# Altium schematic sheet Motor_Module.SchDoc: Название схемы
size 420 x 297 mm; ApprovedBy: Человек 1; CheckedBy: Человек 3; Author: Человек 2; DrawnBy: Человек; DocumentNumber: АЕСН.ХХХХХХ.ХХХЭ3; SheetNumber: x; SheetTotal: x; DocumentName: Sheet1.SCHDOC
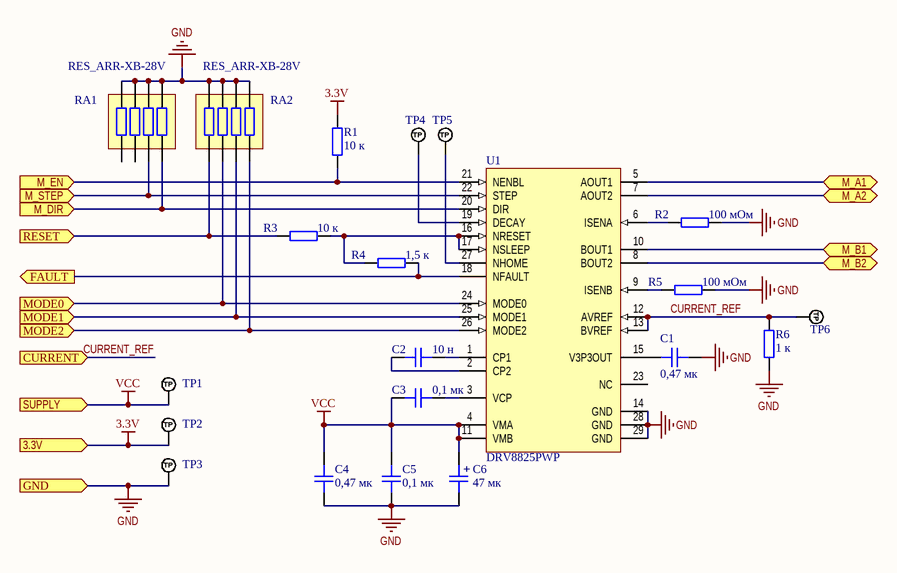
[diagram p0: Motor_Module.SchDoc]

## Parts
C1  0,47 мк  [CAP_0603]
C2  10 н  [CAP_0603]
C3  0,1 мк  [CAP_0603]
C4  0,47 мк  [CAP_0805]
C5  0,1 мк  [CAP_0805]
C6  47 мк  [CAP_AE_SMD_D6MM3_H5M55]
R1  10 к  [RES_0603]
R2  100 мОм  [RES_1206]
R3  10 к  [RES_0603]
R4  1,5 к  [RES_0603]
R5  100 мОм  [RES_1206]
R6  1 к  [RES_0603]
RA1  RES_ARR-XB-28V  [EXB-28V]
RA2  RES_ARR-XB-28V  [EXB-28V]
TP1  SUP  [PAD_RND_1MM]  (value not drawn)  (no BOM)
TP2  SUP  [PAD_RND_1MM]  (value not drawn)  (no BOM)
TP3  GND  [PAD_RND_1MM]  (value not drawn)  (no BOM)
TP4  DECAY  [PAD_RND_1MM]  (value not drawn)  (no BOM)
TP5  NHOME  [PAD_RND_1MM]  (value not drawn)  (no BOM)
TP6  CURRENT  [PAD_RND_1MM]  (value not drawn)  (no BOM)
U1  DRV8825PWP  [PWP0028C_L]

## Ports
3.3V (in), CURRENT (in), FAULT (out), GND (in), M_A1 (bidir), M_A2 (bidir), M_B1 (bidir), M_B2 (bidir), M_DIR (in), M_EN (in), M_STEP (in), MODE0 (in), MODE1 (in), MODE2 (in), RESET (in), SUPPLY (in)

## Nets
3.3V: R1.1 TP2.1(TP) ; port 3.3V
GND: C1.2 C4.2 C5.2 C6.2 R2.2 R5.2 R6.2 RA1.5 RA1.6 RA1.7 RA1.8 RA2.5 RA2.6 RA2.7 RA2.8 TP3.1(TP) U1.14(GND) U1.28(GND) U1.29(GND) ; port GND
VCC: C3.1 C4.1 C5.1 C6.1 TP1.1(TP) U1.4(VMA) U1.11(VMB) ; port SUPPLY
CURRENT_REF: R6.1 TP6.1(TP) U1.12(AVREF) U1.13(BVREF) ; port CURRENT
FAULT: R4.1 U1.18(NFAULT) ; port FAULT
M_A1: U1.5(AOUT1) ; port M_A1
M_A2: U1.7(AOUT2) ; port M_A2
M_B1: U1.10(BOUT1) ; port M_B1
M_B2: U1.8(BOUT2) ; port M_B2
M_DIR: RA1.4 U1.20(DIR) ; port M_DIR
M_EN: R1.2 U1.21(NENBL) ; port M_EN
M_STEP: RA1.3 U1.22(STEP) ; port M_STEP
MODE0: RA2.2 U1.24(MODE0) ; port MODE0
MODE1: RA2.3 U1.25(MODE1) ; port MODE1
MODE2: RA2.4 U1.26(MODE2) ; port MODE2
RESET: R3.2 RA2.1 ; port RESET
NetC1_1: C1.1 U1.15(V3P3OUT)
NetC2_1: C2.1 U1.1(CP1)
NetC2_2: C2.2 U1.2(CP2)
NetC3_2: C3.2 U1.3(VCP)
NetR2_1: R2.1 U1.6(ISENA)
NetR3_1: R3.1 R4.2 U1.16(NRESET) U1.17(NSLEEP)
NetR5_1: R5.1 U1.9(ISENB)
NetTP4_1: TP4.1(TP) U1.19(DECAY)
NetTP5_1: TP5.1(TP) U1.27(NHOME)

Not connected (* = marked no-connect by the designer): RA1 1 2; U1 23(NC)

## Notes on the sheet
- Подп. и дата
- Инв.№ дубл.
- Взам. инв. №
- Инв № подл.
- Изм.
- Лист
- № докум.
- Подп.
- Дата
- Копировал
- Формат А3
- (in symbol CAP_ALEL_6.3x5.5) +

## Library data of the parts
C1 C2 = CAP_0805: Capacitor SMD 0805; Type: CAP_CERAMIC
  C1: Rating: *; Dielectric: *; Value: 0,47 мк
  C2: Value: 10 н
C3-C5 = CAP_0805: Capacitor SMD 0805; Voltage: 50; Type: CAP_CERAMIC
  C3 C5: Value: 0,1 мк
  C4: Value: 0,47 мк
C6 = CAP_ALEL_6.3x5.5: Capacitor SMD Aluminium Electrolytic 6.3mm Diameter 5.5mm Height; ChipDip: 9000565731; Voltage: 50; Type: CAP_ELECTROLYTIC; Value: 47 мк
R1 R3 R4 R6 = RES_0805: Resistor SMD 0805; Type: RESISTOR
  R1 R3: Value: 10 к
  R4: Value: 1,5 к
  R6: Value: 1 к
R2 R5 = RES_1206: Resistor SMD 1206; Value: 100 мОм; Type: RESISTOR
RA1 RA2 = RES_ARR-XB-28V: Resistor Array 0402 4 Elements Panasonic EXB-28V; Manufacturer: Panasonic
TP1-TP6 = TEST_POINT_RND_1MM: Test Point Round 1mm (NO BOM); Type: *
  TP1 TP2: CustomTxt: SUP
  TP3: CustomTxt: GND
  TP4: CustomTxt: DECAY
  TP5: CustomTxt: NHOME
  TP6: CustomTxt: CURRENT
U1 = CMP-1685-00019-1: Stepper Motor Controller IC, 8.2 to 45 V, -40 to 85 degC, 28-Pin HTSSOP (PWP), Green (RoHS & no Sb/Br), Tube; ComponentLink2URL: http://www.ti.com/general/docs/lit/getliterature.tsp?genericPartNumber=DRV8825&fileType=pdf; ComponentLink2Description: Datasheet; ComponentLink1Description: Manufacturer URL; ComponentLink1URL: http://www.ti.com/; Model: DRV8825PWP; Type: IC